# Altium schematic sheet 0X - FPGA_POWER.SchDoc
size A4; SheetNumber: 2; SheetTotal: 1
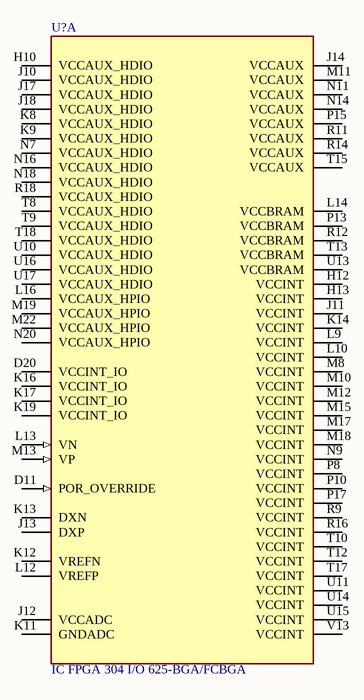
[diagram p0: 0X - FPGA_POWER.SchDoc]

## Parts
U?  IC FPGA 304 I/O 625-BGA/FCBGA  [BGA625C80P25X25_2100X2100X192]  (part A of 11)

## Nets

Not connected (* = marked no-connect by the designer): U? D11(POR_OVERRIDE) D20(VCCINT_IO) H10(VCCAUX_HDIO) H12(VCCINT) H13(VCCINT) J10(VCCAUX_HDIO) J11(VCCINT) J12(VCCADC) J13(DXP) J14(VCCAUX) J17(VCCAUX_HDIO) J18(VCCAUX_HDIO) K8(VCCAUX_HDIO) K9(VCCAUX_HDIO) K11(GNDADC) K12(VREFN) K13(DXN) K14(VCCINT) K16(VCCINT_IO) K17(VCCINT_IO) K19(VCCINT_IO) L9(VCCINT) L10(VCCINT) L12(VREFP) L13(VN) L14(VCCBRAM) L16(VCCAUX_HPIO) M8(VCCINT) M10(VCCINT) M11(VCCAUX) M12(VCCINT) M13(VP) M15(VCCINT) M17(VCCINT) M18(VCCINT) M19(VCCAUX_HPIO) M22(VCCAUX_HPIO) N7(VCCAUX_HDIO) N9(VCCINT) N11(VCCAUX) N14(VCCAUX) N16(VCCAUX_HDIO) N18(VCCAUX_HDIO) N20(VCCAUX_HPIO) P8(VCCINT) P10(VCCINT) P13(VCCBRAM) P15(VCCAUX) P17(VCCINT) R9(VCCINT) R11(VCCAUX) R12(VCCBRAM) R14(VCCAUX) R16(VCCINT) R18(VCCAUX_HDIO) T8(VCCAUX_HDIO) T9(VCCAUX_HDIO) T10(VCCINT) T12(VCCINT) T13(VCCBRAM) T15(VCCAUX) T17(VCCINT) T18(VCCAUX_HDIO) U10(VCCAUX_HDIO) U11(VCCINT) U13(VCCBRAM) U14(VCCINT) U15(VCCINT) U16(VCCAUX_HDIO) U17(VCCAUX_HDIO) V13(VCCINT)

## Notes on the sheet
- LESC - Laboratório de Engenharia e Sistemas de Computação
- Nome da Sheet:
- Data:
- Projetista:
- PCB Design:
- Campus do Pici - Bloco 723, S/N - Pici, Fortaleza - CE, 60455-970
- Julio Vitorino
- Revision:
- Size:
- A4

## Library data of the parts
U? = IC FPGA 304 I/O 625-BGA/FCBGA: IC FPGA 304 I/O 625-BGA/FCBGA PN: XCSU35P-1SBVB625I; MF: AMD; Package: None; Price: None; Value: *; SnapEDA_Link: https://www.snapeda.com/parts/XCSU10P-2SBVB625I/AMD/view-part/?ref=snap; PN: XCSU35P-1SBVB625I; Availability: Unavailable; Check_prices: https://www.snapeda.com/parts/XCSU10P-2SBVB625I/AMD/view-part/?ref=eda